# Altium project KC_BaseBoard4CompareTest-V0.31.PrjPcb
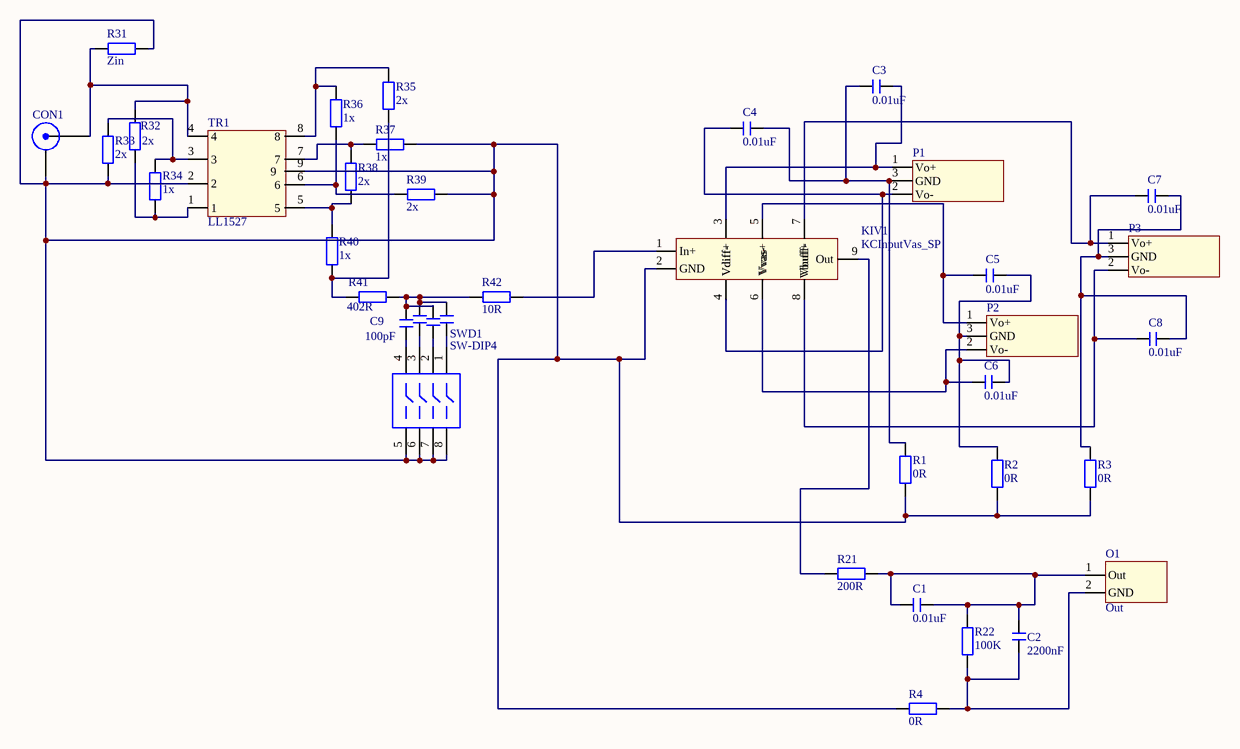
[diagram p0: KC_BaseBoard4CompareTest-V0.31.SchDoc]
1 sheet, 38 parts. Net scope: global (net labels, ports and power ports of the same name join across sheets).
Board file: KC_BaseBoard4CompareTest-V0.31.PcbDoc

## Sheet KC_BaseBoard4CompareTest-V0.31.SchDoc
size A4

### Parts
C1  0.01uF  [CBB 6.3*6.3*5]
C2  2200nF  [CBB 6.3*6.3*5]
C3  0.01uF  [CBB 6.3*6.3*5]
C4  0.01uF  [CBB 6.3*6.3*5]
C5  0.01uF  [CBB 6.3*6.3*5]
C6  0.01uF  [CBB 6.3*6.3*5]
C7  0.01uF  [CBB 6.3*6.3*5]
C8  0.01uF  [CBB 6.3*6.3*5]
C9  100pF  [CBB 6.3*6.3*5]
C10  100pF  [CBB 6.3*6.3*5]  (value not drawn)
C11  100pF  [CBB 6.3*6.3*5]  (value not drawn)
C12  20pF  [CBB 6.3*6.3*5]  (value not drawn)
CON1  RCA  [RCA-RJ255]  (value not drawn)
KIV1  KCInputVas_SP  [KCIn_VAS_SP_M4]
O1  Out  [Signal_Terminal]
P1  Vdiff  [KC_MBPowerReg4Compare-1.5mm]  (value not drawn)
P2  Vvas  [KC_MBPowerReg4Compare-1.5mm]  (value not drawn)
P3  Vbuff  [KC_MBPowerReg4Compare-1.5mm]  (value not drawn)
R1  0R  [RS 1/4W]
R2  0R  [RS 1/4W]
R3  0R  [RS 1/4W]
R4  0R  [RS 1/4W]
R21  200R  [RS 1/4W]
R22  100K  [RS 1/4W]
R31  Zin  [RS 1/4W]
R32  2x  [RS 1/4W]
R33  2x  [RS 1/4W]
R34  1x  [RS 1/4W]
R35  2x  [RS 1/4W]
R36  1x  [RS 1/4W]
R37  1x  [RS 1/4W]
R38  2x  [RS 1/4W]
R39  2x  [RS 1/4W]
R40  1x  [RS 1/4W]
R41  402R  [RS 1/4W]
R42  10R  [RS 1/4W]
SWD1  SW-DIP4  [DIP-8]
TR1  LL1527  [LL1527]

### Nets
NetC1_1: C1.1 C1.2 C2.1 O1.1(Out) R21.1 R22.1
NetC2_2: C2.2 O1.2(GND) R4.1 R22.2
NetC3_1: C3.1 C4.2 P1.3(GND) R1.2
NetC3_2: C3.2 KIV1.3(Vdiff+) P1.1(Vo+)
NetC4_1: C4.1 KIV1.4(Vdiff-) P1.2(Vo-)
NetC5_1: C5.1 KIV1.5(Vvas+) P2.1(Vo+)
NetC5_2: C5.2 C6.2 P2.3(GND) R2.2
NetC6_1: C6.1 KIV1.6(Vvas-) P2.2(Vo-)
NetC7_1: C7.1 KIV1.7(Vbuff+) P3.1(Vo+)
NetC7_2: C7.2 C8.2 P3.3(GND) R3.2
NetC8_1: C8.1 KIV1.8(Vbuff-) P3.2(Vo-)
NetC9_1: C9.1 SWD1.4
NetC9_2: C9.2 C10.2 C11.2 C12.2 R41.2 R42.1
NetC10_1: C10.1 SWD1.3
NetC11_1: C11.1 SWD1.2
NetC12_1: C12.1 SWD1.1
NetCON1_1: CON1.1(X) R31.1 R32.2 TR1.4
NetCON1_2: CON1.2(Y) KIV1.2(GND) R1.1 R2.1 R3.1 R4.2 R31.2 R33.1 R37.2 R39.2 SWD1.5 SWD1.6 SWD1.7 SWD1.8 TR1.2 TR1.9
NetKIV1_1: KIV1.1(In+) R42.2
NetKIV1_9: KIV1.9(Out) R21.2
NetR32_1: R32.1 R34.1 TR1.1
NetR33_2: R33.2 R34.2 TR1.3
NetR35_1: R35.1 R40.1 R41.1
NetR35_2: R35.2 R36.2 TR1.8
NetR36_1: R36.1 R39.1 TR1.6
NetR37_1: R37.1 R38.2 TR1.7
NetR38_1: R38.1 R40.2 TR1.5

### Library data of the parts
C1-C12 = C-CBB: CBB电容; 版权归属: 源创客; BOM名称: CBB电容; 学习资源: www.ooocke.com
CON1 = RCA: RCA Connector; Revision: 17-Jul-2002: Re-released for DXP Platform.; Publisher: Altium Limited
KIV1 = KCInputVas_SP: King Cello Input Stage and VAS for Seperated Power
O1 = Signal_Out: Signal Out
P1-P3 = MainBoardPowerRegulator4CompareTest: King Cello Compare Test Power
R1-R4 R21 R22 R31-R42 = R-CRR: 直插色环电阻; BOM名称: 色环电阻; 版权归属: 源创客; 学习资源: www.ooocke.com
SWD1 = SW-DIP4: DIP Switch; Published: 24-Mar-1999; LatestRevisionDate: 17-Jul-2002; LatestRevisionNote: Re-released for DXP Platform.; PackageReference: DIP-8; Publisher: Altium Limited
TR1 = LL1527: Lundahl LL1527